# Altium schematic sheet SCH_A1_TempClassic.SchDoc
size A1
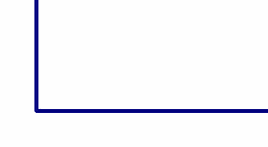
[diagram p0: SCH_A1_TempClassic.SchDoc, bottom left]